# Altium schematic sheet 15_FPGA_misc_banks.SchDoc: FPGA misc
size A3; Organization: Lime Microsystems; Address1: Surrey Tech Centre; Address2: Guildford GU2 7YG; Address3: Surrey; Address4: United Kingdom; Revision: v1.2; SheetNumber: 13; SheetTotal: 27
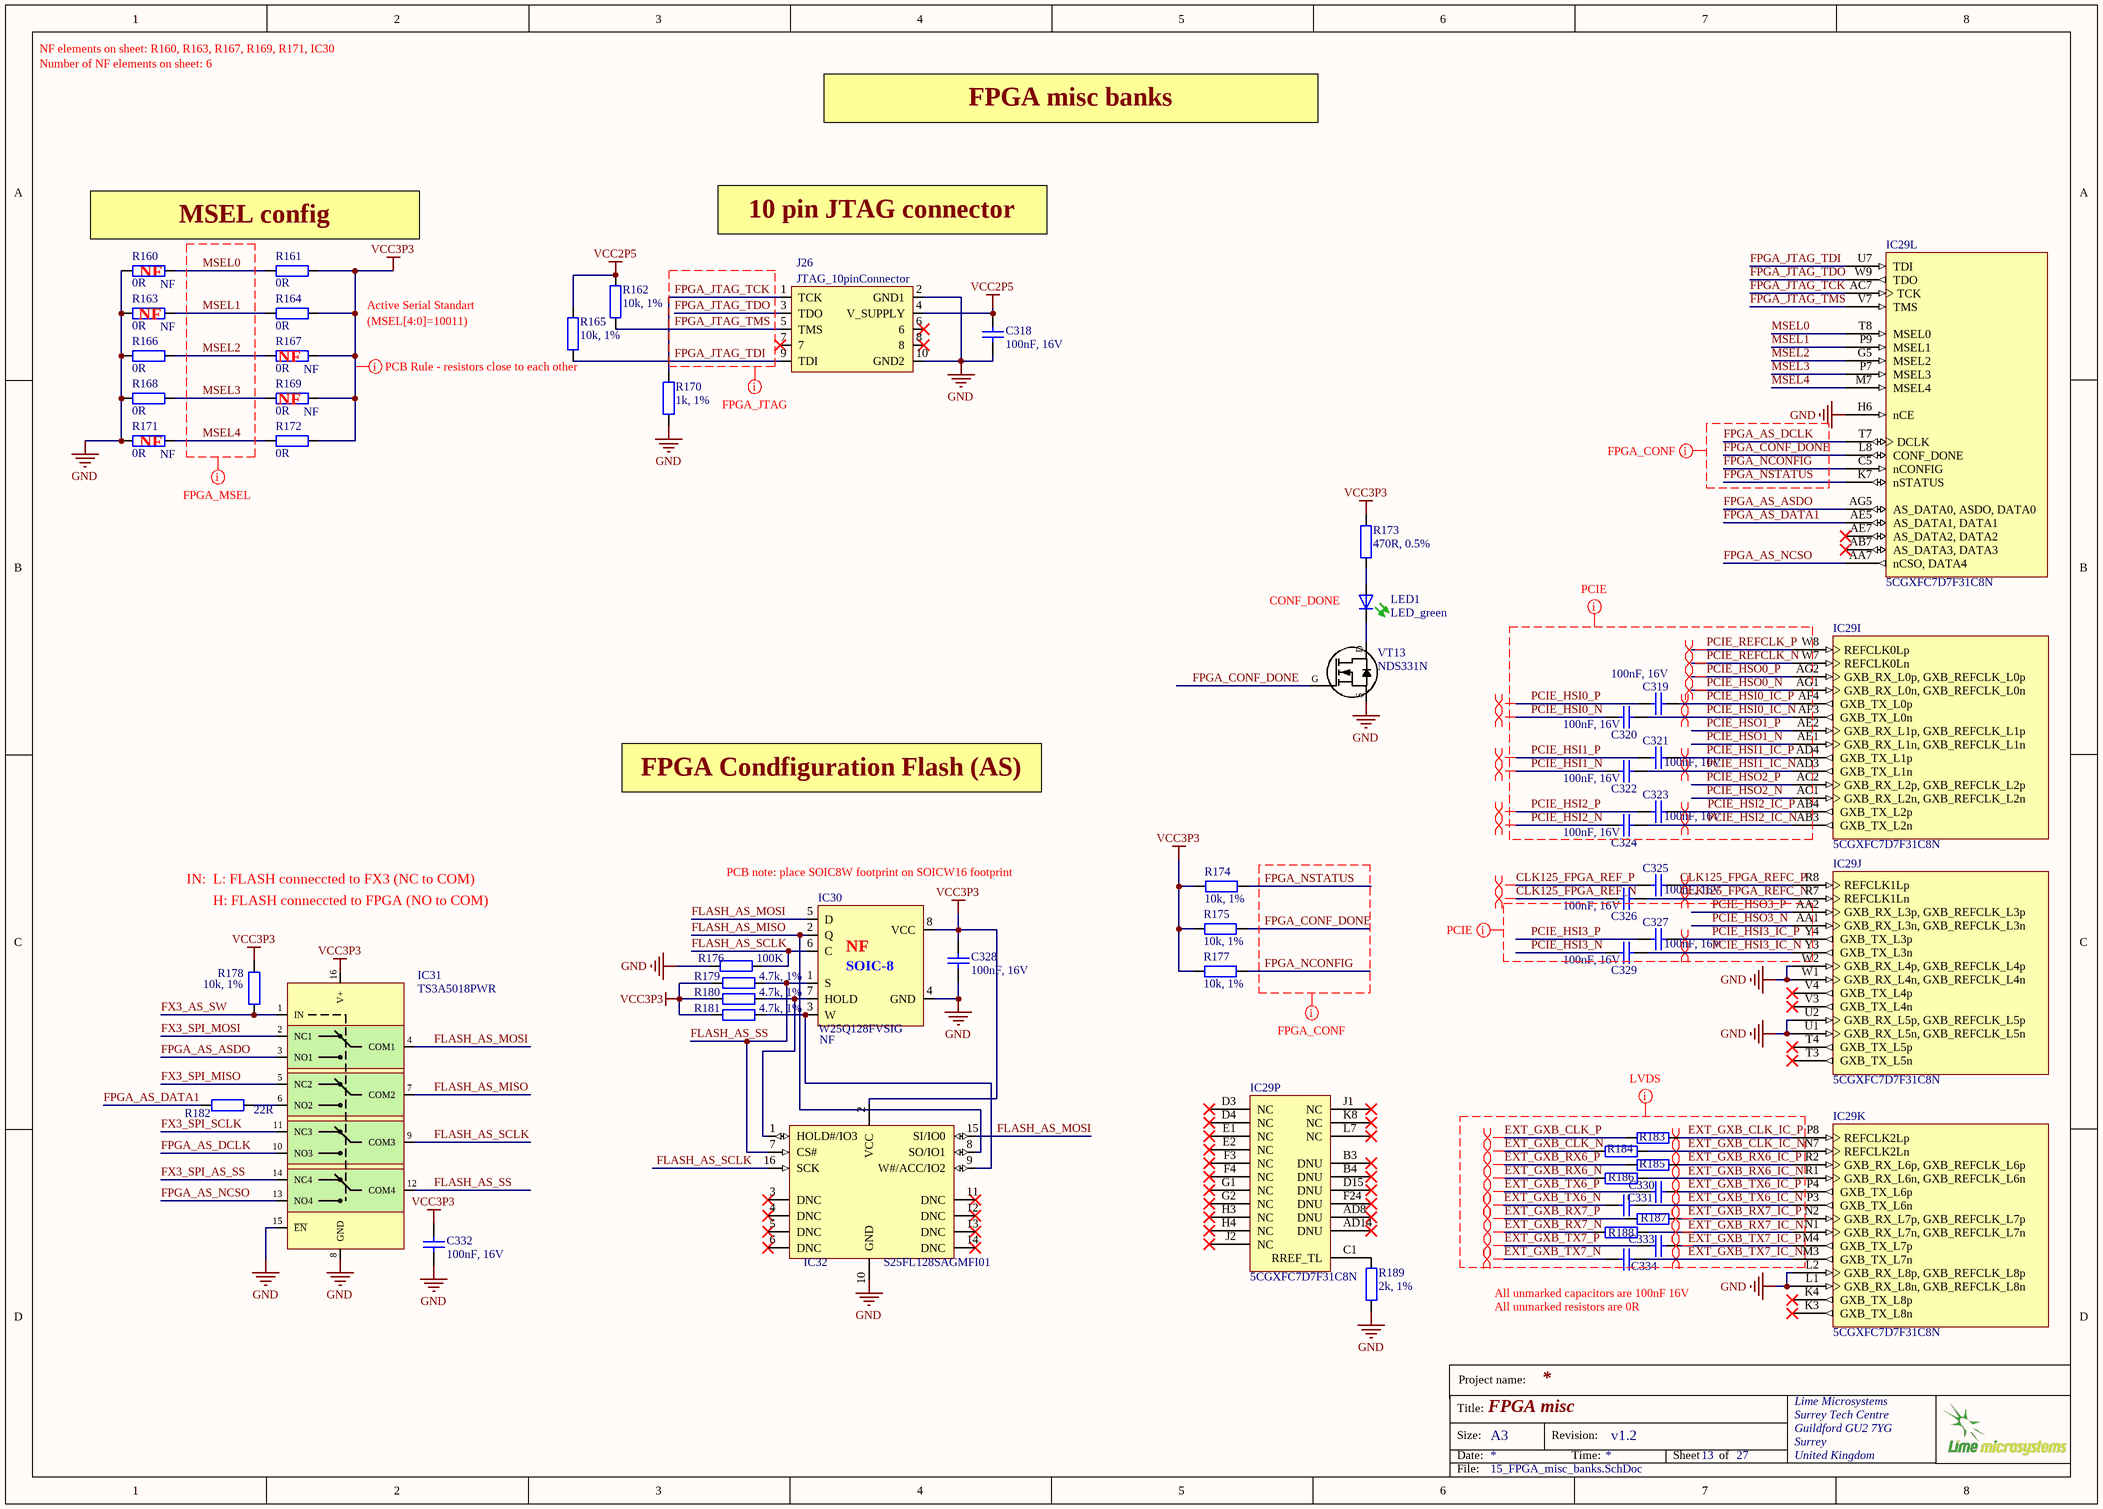
[diagram p0: 15_FPGA_misc_banks.SchDoc]

## Parts
C318  100nF, 16V  [CAP0402]
C319  100nF, 16V  [CAP0402]
C320  100nF, 16V  [CAP0402]
C321  100nF, 16V  [CAP0402]
C322  100nF, 16V  [CAP0402]
C323  100nF, 16V  [CAP0402]
C324  100nF, 16V  [CAP0402]
C325  100nF, 16V  [CAP0402]
C326  100nF, 16V  [CAP0402]
C327  100nF, 16V  [CAP0402]
C328  100nF, 16V  [CAP0402]
C329  100nF, 16V  [CAP0402]
C330  100nF, 16V  [CAP0402]  (value not drawn)
C331  100nF, 16V  [CAP0402]  (value not drawn)
C332  100nF, 16V  [CAP0402]
C333  100nF, 16V  [CAP0402]  (value not drawn)
C334  100nF, 16V  [CAP0402]  (value not drawn)
IC29  5CGXFC7D7F31C8N  [ALTR-FBGA896_A-200]  (parts I,J,K,L,P of 16)
IC30  W25Q128FVSIG  Assembly Info: NF  [S25FL164K_WSO8N]
IC31  TS3A5018PWR  [TS3A5018PWR]
IC32  S25FL128SAGMFI01  [SOIC16_WIDE]
J26  JTAG_10pinConnector  [HEADER5x2_SM]
LED1  LED_green  [LED-0603-GREEN]
R160  0R  Assembly Info: NF  [RES0402]
R161  0R  [RES0402]
R162  10k, 1%  [RES0402]
R163  0R  Assembly Info: NF  [RES0402]
R164  0R  [RES0402]
R165  10k, 1%  [RES0402]
R166  0R  [RES0402]
R167  0R  Assembly Info: NF  [RES0402]
R168  0R  [RES0402]
R169  0R  Assembly Info: NF  [RES0402]
R170  1k, 1%  [RES0402]
R171  0R  Assembly Info: NF  [RES0402]
R172  0R  [RES0402]
R173  470R, 0.5%  [RES0402]
R174  10k, 1%  [RES0402]
R175  10k, 1%  [RES0402]
R176  100K  [RES0402]
R177  10k, 1%  [RES0402]
R178  10k, 1%  [RES0402]
R179  4.7k, 1%  [RES0402]
R180  4.7k, 1%  [RES0402]
R181  4.7k, 1%  [RES0402]
R182  22R  [RES0402]
R183  0R  [RES0402]  (value not drawn)
R184  0R  [RES0402]  (value not drawn)
R185  0R  [RES0402]  (value not drawn)
R186  0R  [RES0402]  (value not drawn)
R187  0R  [RES0402]  (value not drawn)
R188  0R  [RES0402]  (value not drawn)
R189  2k, 1%  [RES0402]
VT13  NDS331N  [SOT23-3]

## Nets
GND: C318.2 C328.2 C332.2 IC29.H6(nCE) IC29.L1(GXB_RX_L8n,_GXB_REFCLK_L8n) IC29.L2(GXB_RX_L8p,_GXB_REFCLK_L8p) IC29.U1(GXB_RX_L5n,_GXB_REFCLK_L5n) IC29.U2(GXB_RX_L5p,_GXB_REFCLK_L5p) IC29.W1(GXB_RX_L4n,_GXB_REFCLK_L4n) IC29.W2(GXB_RX_L4p,_GXB_REFCLK_L4p) IC30.4(GND) IC31.8(GND) IC31.15(~{EN}) IC32.10(GND) J26.2(GND1) J26.10(GND2) R160.2 R163.2 R166.2 R168.2 R170.2 R171.2 R176.2 R189.2 VT13.S
VCC2P5: C318.1 J26.4(V_SUPPLY) R162.1 R165.1
VCC3P3: C328.1 C332.1 IC30.8(VCC) IC31.16(V+) IC32.2(VCC) R161.1 R164.1 R167.1 R169.1 R172.1 R173.2 R174.1 R175.1 R177.1 R178.2 R179.2 R180.2 R181.2
CLK125_FPGA_REF_N: C326.2
CLK125_FPGA_REF_P: C325.2
CLK125_FPGA_REFC_N: C326.1 IC29.R7(REFCLK1Ln)
CLK125_FPGA_REFC_P: C325.1 IC29.R8(REFCLK1Lp)
EXT_GXB_CLK_IC_N: IC29.N7(REFCLK2Ln) R184.1
EXT_GXB_CLK_IC_P: IC29.P8(REFCLK2Lp) R183.1
EXT_GXB_CLK_N: R184.2
EXT_GXB_CLK_P: R183.2
EXT_GXB_RX6_IC_N: IC29.R1(GXB_RX_L6n,_GXB_REFCLK_L6n) R186.1
EXT_GXB_RX6_IC_P: IC29.R2(GXB_RX_L6p,_GXB_REFCLK_L6p) R185.1
EXT_GXB_RX6_N: R186.2
EXT_GXB_RX6_P: R185.2
EXT_GXB_RX7_IC_N: IC29.N1(GXB_RX_L7n,_GXB_REFCLK_L7n) R188.1
EXT_GXB_RX7_IC_P: IC29.N2(GXB_RX_L7p,_GXB_REFCLK_L7p) R187.1
EXT_GXB_RX7_N: R188.2
EXT_GXB_RX7_P: R187.2
EXT_GXB_TX6_IC_N: C331.1 IC29.P3(GXB_TX_L6n)
EXT_GXB_TX6_IC_P: C330.1 IC29.P4(GXB_TX_L6p)
EXT_GXB_TX6_N: C331.2
EXT_GXB_TX6_P: C330.2
EXT_GXB_TX7_IC_N: C334.1 IC29.M3(GXB_TX_L7n)
EXT_GXB_TX7_IC_P: C333.1 IC29.M4(GXB_TX_L7p)
EXT_GXB_TX7_N: C334.2
EXT_GXB_TX7_P: C333.2
FLASH_AS_MISO: IC30.2(Q) IC31.7(COM2) IC32.8(SO/IO1)
FLASH_AS_MOSI: IC30.5(D) IC31.4(COM1) IC32.15(SI/IO0)
FLASH_AS_SCLK: IC30.6(C) IC31.9(COM3) IC32.16(SCK) R176.1
FLASH_AS_SS: IC30.1(S) IC31.12(COM4) IC32.7(CS#) R179.1
FPGA_AS_ASDO: IC29.AG5(AS_DATA0,_ASDO,_DATA0) IC31.3(NO1)
FPGA_AS_DATA1: IC29.AE5(AS_DATA1,_DATA1) R182.2
FPGA_AS_DCLK: IC29.T7(DCLK) IC31.10(NO3)
FPGA_AS_NCSO: IC29.AA7(nCSO,_DATA4) IC31.13(NO4)
FPGA_CONF_DONE: IC29.L8(CONF_DONE) R175.2 VT13.G
FPGA_JTAG_TCK: IC29.AC7(TCK) J26.1(TCK) R170.1
FPGA_JTAG_TDI: IC29.U7(TDI) J26.9(TDI) R165.2
FPGA_JTAG_TDO: IC29.W9(TDO) J26.3(TDO)
FPGA_JTAG_TMS: IC29.V7(TMS) J26.5(TMS) R162.2
FPGA_NCONFIG: IC29.C5(nCONFIG) R177.2
FPGA_NSTATUS: IC29.K7(nSTATUS) R174.2
FX3_AS_SW: IC31.1(IN) R178.1
FX3_SPI_AS_SS: IC31.14(NC4)
FX3_SPI_MISO: IC31.5(NC2)
FX3_SPI_MOSI: IC31.2(NC1)
FX3_SPI_SCLK: IC31.11(NC3)
MSEL0: IC29.T8(MSEL0) R160.1 R161.2
MSEL1: IC29.P9(MSEL1) R163.1 R164.2
MSEL2: IC29.G5(MSEL2) R166.1 R167.2
MSEL3: IC29.P7(MSEL3) R168.1 R169.2
MSEL4: IC29.M7(MSEL4) R171.1 R172.2
PCIE_HSI0_IC_N: C320.1 IC29.AF3(GXB_TX_L0n)
PCIE_HSI0_IC_P: C319.1 IC29.AF4(GXB_TX_L0p)
PCIE_HSI0_N: C320.2
PCIE_HSI0_P: C319.2
PCIE_HSI1_IC_N: C322.1 IC29.AD3(GXB_TX_L1n)
PCIE_HSI1_IC_P: C321.1 IC29.AD4(GXB_TX_L1p)
PCIE_HSI1_N: C322.2
PCIE_HSI1_P: C321.2
PCIE_HSI2_IC_N: C324.1 IC29.AB3(GXB_TX_L2n)
PCIE_HSI2_IC_P: C323.1 IC29.AB4(GXB_TX_L2p)
PCIE_HSI2_N: C324.2
PCIE_HSI2_P: C323.2
PCIE_HSI3_IC_N: C329.1 IC29.Y3(GXB_TX_L3n)
PCIE_HSI3_IC_P: C327.1 IC29.Y4(GXB_TX_L3p)
PCIE_HSI3_N: C329.2
PCIE_HSI3_P: C327.2
PCIE_HSO0_N: IC29.AG1(GXB_RX_L0n,_GXB_REFCLK_L0n)
PCIE_HSO0_P: IC29.AG2(GXB_RX_L0p,_GXB_REFCLK_L0p)
PCIE_HSO1_N: IC29.AE1(GXB_RX_L1n,_GXB_REFCLK_L1n)
PCIE_HSO1_P: IC29.AE2(GXB_RX_L1p,_GXB_REFCLK_L1p)
PCIE_HSO2_N: IC29.AC1(GXB_RX_L2n,_GXB_REFCLK_L2n)
PCIE_HSO2_P: IC29.AC2(GXB_RX_L2p,_GXB_REFCLK_L2p)
PCIE_HSO3_N: IC29.AA1(GXB_RX_L3n,_GXB_REFCLK_L3n)
PCIE_HSO3_P: IC29.AA2(GXB_RX_L3p,_GXB_REFCLK_L3p)
PCIE_REFCLK_N: IC29.W7(REFCLK0Ln)
PCIE_REFCLK_P: IC29.W8(REFCLK0Lp)
NetIC29_C1: IC29.C1(RREF_TL) R189.1
NetIC30_3: IC30.3(W) IC32.9(W#/ACC/IO2) R181.1
NetIC30_7: IC30.7(HOLD) IC32.1(HOLD#/IO3) R180.1
NetIC31_6: IC31.6(NO2) R182.1
NetLED1_A: LED1.A R173.1
NetLED1_K: LED1.K(C) VT13.D

Not connected (* = marked no-connect by the designer): IC29 AB7(AS_DATA3,_DATA3)* AD8(DNU)* AD14(DNU)* AE7(AS_DATA2,_DATA2)* B3(DNU)* B4(DNU)* D3(NC)* D4(NC)* D15(DNU)* E1(NC)* E2(NC)* F3(NC)* F4(NC)* F24(DNU)* G1(NC)* G2(NC)* H3(NC)* H4(NC)* J1(NC)* J2(NC)* K3(GXB_TX_L8n)* K4(GXB_TX_L8p)* K8(NC)* L7(NC)* T3(GXB_TX_L5n)* T4(GXB_TX_L5p)* V3(GXB_TX_L4n)* V4(GXB_TX_L4p)*; IC32 3(DNC)* 4(DNC)* 5(DNC)* 6(DNC)* 11(DNC)* 12(DNC)* 13(DNC)* 14(DNC)*; J26 6* 7* 8*

## Layout directives
net class FPGA_CONF: FPGA_AS_DCLK, FPGA_CONF_DONE, FPGA_NCONFIG, FPGA_NSTATUS
differential pair: CLK125_FPGA_REF_N, CLK125_FPGA_REF_P, CLK125_FPGA_REFC_N, CLK125_FPGA_REFC_P, EXT_GXB_CLK_IC_N, EXT_GXB_CLK_IC_P, EXT_GXB_CLK_N, EXT_GXB_CLK_P, EXT_GXB_RX6_IC_N, EXT_GXB_RX6_IC_P, EXT_GXB_RX6_N, EXT_GXB_RX6_P, EXT_GXB_RX7_IC_N, EXT_GXB_RX7_IC_P, EXT_GXB_RX7_N, EXT_GXB_RX7_P, EXT_GXB_TX6_IC_N, EXT_GXB_TX6_IC_P, EXT_GXB_TX6_N, EXT_GXB_TX6_P, EXT_GXB_TX7_IC_N, EXT_GXB_TX7_IC_P, EXT_GXB_TX7_N, EXT_GXB_TX7_P, PCIE_HSI0_IC_N, PCIE_HSI0_IC_P, PCIE_HSI0_N, PCIE_HSI0_P, PCIE_HSI1_IC_N, PCIE_HSI1_IC_P, PCIE_HSI1_N, PCIE_HSI1_P, PCIE_HSI2_IC_N, PCIE_HSI2_IC_P, PCIE_HSI2_N, PCIE_HSI2_P, PCIE_HSI3_IC_N, PCIE_HSI3_IC_P, PCIE_HSO0_N, PCIE_HSO0_P, PCIE_REFCLK_N, PCIE_REFCLK_P
rule Undefined: VCC3P3
net class FPGA_MSEL: MSEL0, MSEL1, MSEL2, MSEL3, MSEL4
net class PCIE: PCIE_HSI0_IC_N, PCIE_HSI0_IC_P, PCIE_HSI0_N, PCIE_HSI0_P, PCIE_HSI1_IC_N, PCIE_HSI1_IC_P, PCIE_HSI1_N, PCIE_HSI1_P, PCIE_HSI2_IC_N, PCIE_HSI2_IC_P, PCIE_HSI2_N, PCIE_HSI2_P, PCIE_HSI3_IC_N, PCIE_HSI3_IC_P, PCIE_HSI3_N, PCIE_HSI3_P, PCIE_HSO0_N, PCIE_HSO0_P, PCIE_HSO1_N, PCIE_HSO1_P, PCIE_HSO2_N, PCIE_HSO2_P, PCIE_HSO3_N, PCIE_HSO3_P, PCIE_REFCLK_N, PCIE_REFCLK_P
net class FPGA_JTAG: FPGA_JTAG_TCK, FPGA_JTAG_TDI, FPGA_JTAG_TDO, FPGA_JTAG_TMS
net class LVDS: EXT_GXB_CLK_IC_N, EXT_GXB_CLK_IC_P, EXT_GXB_CLK_N, EXT_GXB_CLK_P, EXT_GXB_RX6_IC_N, EXT_GXB_RX6_IC_P, EXT_GXB_RX6_N, EXT_GXB_RX6_P, EXT_GXB_RX7_IC_N, EXT_GXB_RX7_IC_P, EXT_GXB_RX7_N, EXT_GXB_RX7_P, EXT_GXB_TX6_IC_N, EXT_GXB_TX6_IC_P, EXT_GXB_TX6_N, EXT_GXB_TX6_P, EXT_GXB_TX7_IC_N, EXT_GXB_TX7_IC_P, EXT_GXB_TX7_N, EXT_GXB_TX7_P

## Notes on the sheet
- NF elements on sheet: R160, R163, R167, R169, R171, IC30
- Number of NF elements on sheet: 6
- FPGA misc banks
- MSEL config
- 10 pin JTAG connector
- (near R160) NF
- Active Serial Standart
- (near R163) NF
- (near R167) NF
- (MSEL[4:0]=10011)
- (near R171) NF
- (near R169) NF
- CONF_DONE
- FPGA Condfiguration Flash (AS)
- IN:
- H: FLASH conneccted to FPGA (NO to COM)
- L: FLASH conneccted to FX3 (NC to COM)
- (near IC30) PCB note: place SOIC8W footprint on SOICW16 footprint
- (near IC30) NF
- All unmarked capacitors are 100nF 16V
- All unmarked resistors are 0R
- Project name:
- Title:
- Size:
- Date:
- A3
- Revision:
- Time:
- Sheet
- of
- File:
- (in symbol M25P40) SOIC-8

## Library data of the parts
C318-C327 C329-C331 C333 C334 = Cap_0603: Part Description: 0.10µF ±10% 16V Ceramic Capacitor X7R 0402 (1005 Metric); Manufacturer Part Number 1: GRM155R71C104KA88D; Brand: Murata Electronics; Tolerance: 10 %; Type: General Purpose MLCC; Capacitance: 0.1 uF; Temperature Coefficient / Code: +/- 15 %; Case Height: 0.5 mm; Case Length: 1 mm; Dielectric: X7R; Supplier 1: Mouser; Supplier Part Number 1: 81-GRM155R71C104KA88; Case Code - in: 0402; Manufacturer: Murata Electronics; Category: Multilayer Ceramic Capacitors MLCC - SMD/SMT; Voltage Rating DC: 16 V; Value: 100nF, 16V; Case Code - mm: 1005; Case Width: 0.5 mm; Manufacturer Part Number: GRM155R71C104KA88D; Maximum Operating Temperature: + 125 C; Minimum Operating Temperature: - 55 C; Minimum Order Quantity: 1; Operating Temperature Range: - 55 C to + 125 C; Package / Case: 0402 (1005 metric); Packaging: Reel; Product: General Type MLCCs; Product Category: Low & Medium Capacitance SMD Ceramic Chip Capacitors; Reeling: True; RoHS - Mouser: Y; RoHS: RoHS Compliant; Series: GRM; Standard Pack Qty: 10000; Termination Style: SMD/SMT
C328 C332 = Cap_0603: Manufacturer Part Number 1: GRM155R71C104KA88D; Part Description: 0.10µF ±10% 16V Ceramic Capacitor X7R 0402 (1005 Metric); Brand: Murata Electronics; Tolerance: 10 %; Type: General Purpose MLCC; Capacitance: 0.1 uF; Temperature Coefficient / Code: +/- 15 %; Case Height: 0.5 mm; Case Length: 1 mm; Dielectric: X7R; Supplier 1: Mouser; Supplier Part Number 1: 81-GRM155R71C104KA88; Case Code - in: 0402; Manufacturer: Murata Electronics; Category: Multilayer Ceramic Capacitors MLCC - SMD/SMT; Voltage Rating DC: 16 V; Value: 100nF, 16V; Manufacturer Part Number: GRM155R71C104KA88D; Case Code - mm: 1005; Case Width: 0.5 mm; Maximum Operating Temperature: + 125 C; Minimum Operating Temperature: - 55 C; Minimum Order Quantity: 1; Operating Temperature Range: - 55 C to + 125 C; Package / Case: 0402 (1005 metric); Packaging: Reel; Product: General Type MLCCs; Product Category: Low & Medium Capacitance SMD Ceramic Chip Capacitors; Reeling: True; RoHS - Mouser: Y; RoHS: RoHS Compliant; Series: GRM; Standard Pack Qty: 10000; Termination Style: SMD/SMT
IC29 = 5CGXFC7D7F31C8N: Cyclone V GX Family FPGA, 1.07 to 1.13 V Supply, 480 I/O Pins, 7 PLLs, 896-Pin FBGA, Speed Grade 8, Commercial Grade, RoHS Compliant; Manufacturer: Altera; Part Description: IC FPGA 480 I/O 896FBGA; GPIO: 480; Logic Elements (LE) (K): 149.5; Speed Grade: 8; DatasheetVersion: Rev. 3.4; PackageVersion: Rev. 2.0, 12/2012; PackageReference: FBGA896_A-200; PackageDescription: 896-Pin FineLine Ball-Grid Array (FBGA), Body 31 x 31 mm, Pitch 1 mm; Supplier 1: Digi-Key; Supplier Part Number 1: 544-2772-ND; Supplier 2: Mouser; Supplier Part Number 2: 989-5CGXFC7D7F31C8N; Device Group: 5CGXFC7; RoHS: RoHS Compliant; Subcategory: Cyclone V GX; Voltage Supply: 1.07 to 1.13 V; NexusDeviceID: 5CGXFC7D7F31C8N; Mounting Technology: Surface Mount; Code_JEDEC: MS-034-AAN-1; PartNumber: 5CGXFC7D7F31C8N; ComponentLink1Description: Manufacturer URL; ComponentLink1URL: http://www.altera.com; ComponentLink2Description: Datasheet; ComponentLink2URL: http://www.altera.com/literature/hb/cyclone-v/cv_51002.pdf; ComponentLink3Description: Package Specification; ComponentLink3URL: http://www.altera.com/devicepackaging/04R00435-01.pdf; ComponentLink4Description: Device Handbook URL; ComponentLink4URL: http://www.altera.com/literature/hb/cyclone-v/cyclone5_handbook.pdf; ComponentLink5Description: Device Pin-Out URL; ComponentLink5URL: http://www.altera.com/literature/dp/cyclone-v/5CGXFC7.xls; ComponentLink6Description: Device Overview URL; ComponentLink6URL: http://www.altera.com/literature/hb/cyclone-v/cv_51001.pdf; ComponentLink7Description: Product URL; ComponentLink7URL: http://www.buyaltera.com/scripts/partsearch.dll?Detail&name=5CGXFC7D7F31C8N-ND
IC30 = M25P40: Manufacturer: Winbond Electronics; Part Description: IC FLASH 128MBIT 104MHZ 8SOIC; Interface: SPI Serial; Speed: 104MHz; Memory Size: 128M (16M x 8); Voltage - Supply: 2.7 V ~ 3.6 V; Memory Type: FLASH; Supplier 1: Digi-Key; Supplier Part Number 1: W25Q128FVSIG-ND; Package / Case: 8-SOIC (0.209", 5.30mm Width); Supplier Device Package: 8-SOIC; Manufacturer Part Number 1: W25Q128FVSIG; Operating Temperature: -40°C ~ 85°C; RoHS: RoHS Compliant; Packaging: Tube; Format - Memory: FLASH; Category: Integrated Circuits (ICs)
IC31 = TS3A5018PWR: Manufacturer: Texas Instruments; Part Description: 4 Circuit IC Switch 2:1 10 Ohm 16-TSSOP; Switch Circuit: SPDT; Multiplexer/Demultiplexer Circuit: 2:1; Number of Circuits: 4; On-State Resistance (Max): 10 Ohm; Channel-to-Channel Matching (&Delta;Ron): 300 mOhm; Voltage - Supply, Single (V+): 1.65 V ~ 3.6 V; Switch Time (Ton, Toff) (Max): 8ns, 6.5ns; -3db Bandwidth: 300MHz; Charge Injection: 2pC; Channel Capacitance (CS(off), CD(off)): 4.5pF, 9pF; Current - Leakage (IS(off)) (Max): 100nA; Crosstalk: -48dB @ 10MHz; Supplier 1: Digi-Key; Supplier Part Number 1: 296-17612-1-ND; Manufacturer Part Number 1: TS3A5018PWR; RoHS: RoHS Compliant; Category: Integrated Circuits (ICs); Stock 1: 4598; Pricing 1: 1=0.79, 10=0.694, 100=0.5304, 500=0.42024, 1000=0.3366 (USD); Packaging: Cut Tape (CT); Part Status: Active; Voltage - Supply, Dual (V±): -; Operating Temperature: -40°C ~ 85°C (TA); Package / Case: 16-TSSOP (0.173", 4.40mm Width); Supplier Device Package: 16-TSSOP; ComponentLink1URL: http://www.ti.com/lit/ds/symlink/ts3a5018.pdf; ComponentLink1Description: http://www.ti.com/lit/ds/symlink/ts3a5018.pdf
IC32 = S25FL032P: Manufacturer Part Number: S25FL128SAGMFI010; Manufacturer: Spansion; Part Description: IC FLASH 128MBIT 133MHZ 16SO; Interface: SPI Serial; Speed: 133MHz; Memory Size: 128M (16M x 8); Memory Type: FLASH - NOR; Voltage - Supply: 2.7 V ~ 3.6 V; Format - Memory: FLASH; Supplier Device Package: 16-SO; Package / Case: 16-SOIC (0.295", 7.50mm Width); Packaging: Tray; Operating Temperature: -40°C ~ 85°C; RoHS: RoHS Compliant; Supplier 1: Digi-Key; Supplier Part Number 1: 1274-1140-ND; Category: Integrated Circuits (ICs)
J26 = JTAG_connector_10pin: Manufacturer Part Number 1: 54202-G0805LF; Part Description: 10 Positions Header, Unshrouded Connector 0.100" (2.54mm) Surface Mount Gold or Gold, GXT; Manufacturer: Amphenol FCI; Connector Type: Header, Unshrouded; Number of Positions: 10; Number of Positions Loaded: All; Supplier 1: Digi-Key; Supplier Part Number 1: 609-4723-ND; Contact Type: Male Pin; Category: Connectors, Interconnects; Contact Finish: Gold or Gold, GXT™; Color: Black; Number of Rows: 2; Mounting Type: Surface Mount
LED1 = LED_green: Part Description: Green 572nm LED Indication - Discrete 2.2V 0603 (1608 Metric); Manufacturer Part Number 1: HSMG-C190; Manufacturer: Avago Technologies US Inc.; Current - Test: 20mA; Voltage - Forward (Vf) (Typ): 2.2V; Color: Green; Supplier 1: Digi-Key; Supplier Part Number 1: 516-1425-2-ND; Category: Optoelectronics; Package / Case: 0603 (1608 Metric)
R160 R161 R163 R164 R166-R169 R171 R172 = Res_0402: Manufacturer: Yageo; Part Description: RES SMD 0.0OHM JUMPER 1/16W 0402; Manufacturer Part Number 1: RC0402JR-070RL; Supplier 1: Digi-Key; Supplier Part Number 1: 311-0.0JRTR-ND; Composition: Thick Film; Package / Case: 0402 (1005 Metric); Category: Resistors; Value: 0R
R162 R165 R174 R175 R177 R178 = Res_0402: Manufacturer: Yageo; Manufacturer Part Number 1: RC0402FR-0710KL; Part Description: RES SMD 10K OHM 1% 1/16W 0402; Temperature Coefficient: ±100ppm/°C; Power (Watts): 0.063W, 1/16W; Value: 10k, 1%; Supplier 1: Digi-Key; Supplier Part Number 1: 311-10.0KLRTR-ND; Resistance (Ohms): 10k; Packaging: Tape & Reel (TR); RoHS: RoHS Compliant; Package / Case: 0402 (1005 Metric); Tolerance: ±1%; Operating Temperature: -55°C ~ 155°C; Size / Dimension: 0.039" L x 0.020" W (1.00mm x 0.50mm); Number of Terminations: 2; Category: Resistors; Height: 0.016" (0.40mm); Supplier Device Package: 0402; Features: Moisture Resistant; Composition: Thick Film
R170 = Res_0402: Manufacturer: Stackpole Electronics Inc; Manufacturer Part Number 1: RMCF0402FT1K00; Part Description: RES SMD 1K OHM 1% 1/16W 0402; Temperature Coefficient: ±100ppm/°C; Power (Watts): 0.063W, 1/16W; Value: 1k, 1%; Supplier 1: Digi-Key; Supplier Part Number 1: RMCF0402FT1K00TR-ND; Package / Case: 0402 (1005 Metric); Supplier Device Package: 0402; Height: 0.016" (0.40mm); Size / Dimension: 0.039" L x 0.020" W (1.00mm x 0.50mm); Number of Terminations: 2; Packaging: Cut Tape (CT); Category: Resistors; Composition: Thick Film; Resistance (Ohms): 1k; Tolerance: ±1%; Features: Moisture Resistant; Operating Temperature: -55°C ~ 155°C; RoHS: RoHS Compliant
R173 = Res_0402: Part Description: RES SMD 470 OHM 0.5% 1/16W 0402; Manufacturer Part Number 1: ERA-2AED471X; Manufacturer: Panasonic Electronic Components; Temperature Coefficient: ±25ppm/°C; Supplier 1: Digi-Key; Supplier Part Number 1: P470DETR-ND; Category: Resistors; Number of Terminations: 2; Composition: Thin Film; Tolerance: ±0.5%; value: 470R, 0.5%
R176 = Res_0402: Manufacturer Part Number 1: ERJ-2GEJ104X; Manufacturer: Panasonic Electronic Components; Part Description: RES SMD 100K OHM 5% 1/10W 0402; Tolerance: ±5%; Temperature Coefficient: ±200ppm/°C; Power (Watts): 0.1W, 1/10W; Supplier 1: Digi-Key; Supplier Part Number 1: P100KJCT-ND; Resistance (Ohms): 100k; Composition: Thick Film; Features: Automotive AEC-Q200; Number of Terminations: 2; Height: 0.016" (0.40mm); RoHS: RoHS Compliant; Package / Case: 0402 (1005 Metric); Packaging: Cut Tape (CT); Size / Dimension: 0.039" L x 0.020" W (1.00mm x 0.50mm); Supplier Device Package: 0402; Operating Temperature: -55°C ~ 155°C; Category: Resistors; value: 100K
R179-R181 = Res_0402: Manufacturer: Yageo; Part Description: RES SMD 4.7K OHM 1% 1/16W 0402; Manufacturer Part Number1: RC0402FR-074K7L; Temperature Coefficient: ±100ppm/°C; Power (Watts): 0.063W, 1/16W; Number of Terminations: 2; Category: Resistors; Supplier 1: Digi-Key; Height: 0.016" (0.40mm); Features: Moisture Resistant; Size / Dimension: 0.039" L x 0.020" W (1.00mm x 0.50mm); Supplier Device Package: 0402; RoHS: RoHS Compliant; Composition: Thick Film; Package / Case: 0402 (1005 Metric); Resistance (Ohms): 4.7k; Operating Temperature: -55°C ~ 155°C; Tolerance: ±1%; Supplier Part Number 1: 311-4.7KLRCT-ND; Packaging: Cut Tape (CT); Value: 4.7k, 1%
R182 = Res_0402: Part Description: RES SMD 22 OHM 1% 1/16W 0402; Manufacturer Part Number 1: RC0402FR-0722RL; Manufacturer: Yageo; Tolerance: ±1%; Temperature Coefficient: ±100ppm/°C; Resistance (Ohms): 22; Supplier 1: Digi-Key; Supplier Part Number 1: 311-22.0LRTR-ND; Supplier Device Package: 0402; Composition: Thick Film; Category: Resistors; Value: 22R
R183-R188 = Res_0402: Manufacturer Part Number 1: RC0402JR-070RL; Manufacturer: Yageo; Part Description: RES SMD 0.0OHM JUMPER 1/16W 0402; Resistance (Ohms): 0.0; Tolerance: Jumper; Power (Watts): 0.063W, 1/16W; Value: 0R; Supplier 1: Digi-Key; Supplier Part Number 1: 311-0.0JRTR-ND; Category: Resistors; Temperature Coefficient: -; Features: Moisture Resistant; Supplier Device Package: 0402; Height: 0.016" (0.40mm); Package / Case: 0402 (1005 Metric); Operating Temperature: -55°C ~ 155°C; Size / Dimension: 0.039" L x 0.020" W (1.00mm x 0.50mm); Composition: Thick Film; Packaging: Tape & Reel (TR); Number of Terminations: 2; RoHS: RoHS Compliant
R189 = Res_0402: Manufacturer: Yageo; Part Description: RES SMD 2K OHM 1% 1/16W 0402; Manufacturer Part Number 1: RC0402FR-072KL; Power (Watts): 0.063W, 1/16W; Temperature Coefficient: ±100ppm/°C; Packaging: Cut Tape (CT); Size / Dimension: 0.039" L x 0.020" W (1.00mm x 0.50mm); Operating Temperature: -55°C ~ 155°C; Resistance (Ohms): 2k; Number of Terminations: 2; Supplier Device Package: 0402; Tolerance: ±1%; Features: Moisture Resistant; Category: Resistors; Height: 0.016" (0.40mm); Composition: Thick Film; Supplier 1: Digi-Key; Supplier Part Number 1: 311-2KLRCT-ND; Package / Case: 0402 (1005 Metric); RoHS: RoHS Compliant; Value: 2k, 1%
VT13 = NDS331N: Part Description: MOSFET N-CH 20V 1.3A SSOT3; Manufacturer: Fairchild Semiconductor; Gate Charge (Qg) @ Vgs: 5nC @ 4.5V; Power - Max: 460mW; Current - Continuous Drain (Id) @ 25°C: 1.3A (Ta); Input Capacitance (Ciss) @ Vds: 162pF @ 10V; FET Type: MOSFET N-Channel, Metal Oxide; Drain to Source Voltage (Vdss): 20V; FET Feature: Logic Level Gate; Supplier Device Package: 3-SSOT; Category: Discrete Semiconductor Products; Mounting Type: Surface Mount; Package / Case: TO-236-3, SC-59, SOT-23-3; Supplier 1: Digi-Key; Supplier Part Number 1: NDS331NCT-ND; Manufacturer Part Number: NDS331N; Manufacturer Part Number 1: NDS331N